# EAGLE design fuzz_sch (EAGLE 8.0.2)
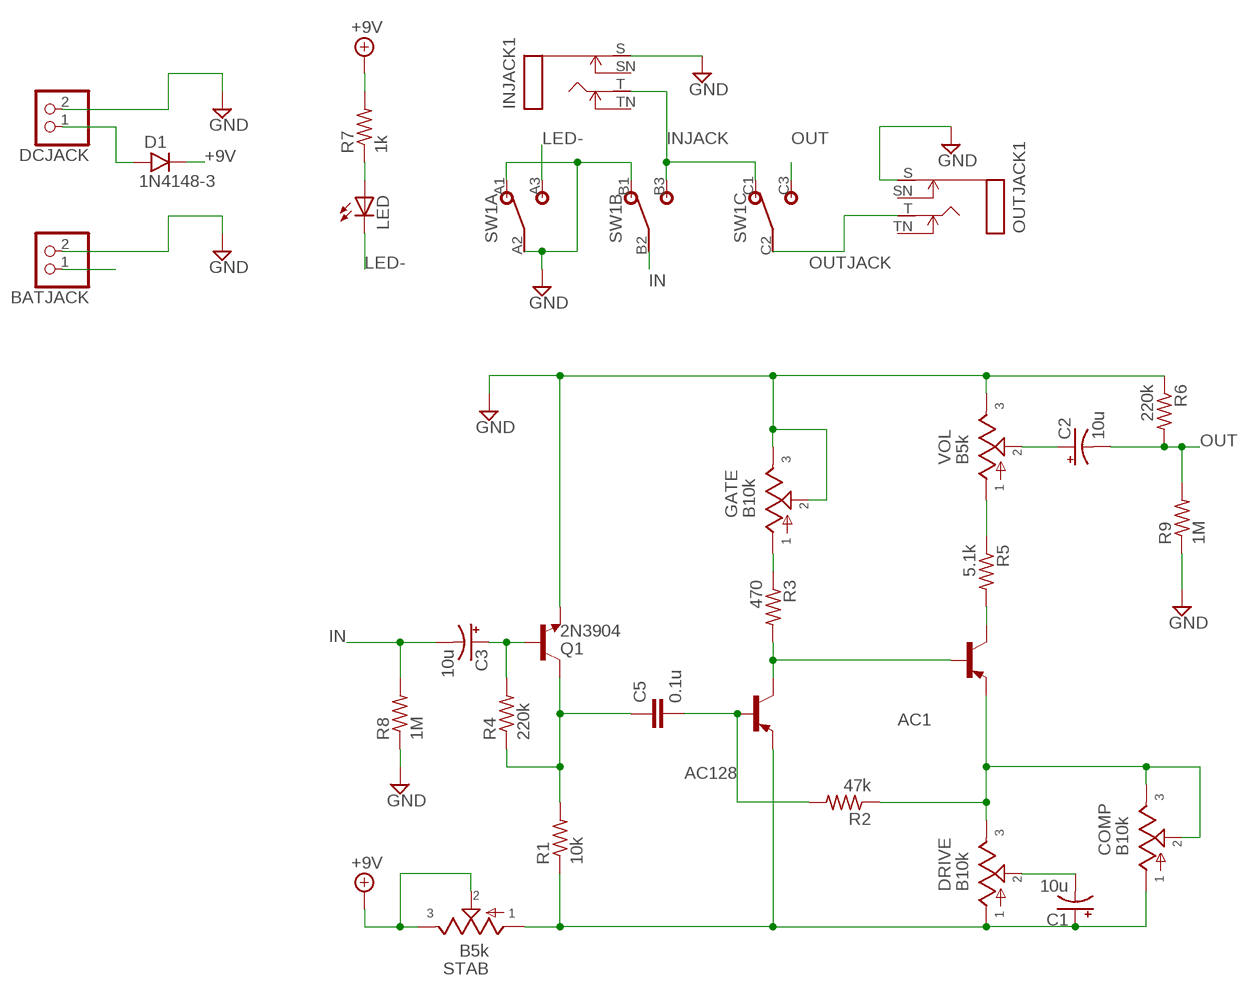
[diagram p0: schematic, sheet 1]

## Parts
AC1  -PNP-TO5  [TO5]
AC128  -PNP-TO5  [TO5]
BATJACK  PINHD-1X2  [1X02]
C1  10u  0631  [063_025]
C2  10u  0631  [063_025]
C3  10u  0631  [063_025]
C5  0.1u  072X0352  [072X035]
COMP  B10k  POT16MM  [16MM]
D1  1N4148-3  [DO35-3]
DCJACK  PINHD-1X2  [1X02]
DRIVE  B10k  POT16MM  [16MM]
GATE  B10k  POT16MM  [16MM]
INJACK1  MONOSWS  [NMJ4HC-S]
LED  LED5MM  [LED5MM]
OUTJACK1  MONOSWS  [NMJ4HC-S]
Q1  2N3904  [TO92-]
R1  10k  R-US_0207/10  [0207/10]
R2  47k  R-US_0207/10  [0207/10]
R3  470  R-US_0207/10  [0207/10]
R4  220k  R-US_0207/10  [0207/10]
R5  5.1k  R-US_0207/10  [0207/10]
R6  220k  R-US_0207/10  [0207/10]
R7  1k  R-US_0207/10  [0207/10]
R8  1M  R-US_0207/10  [0207/10]
R9  1M  R-US_0207/10  [0207/10]
STAB  B5k  POT16MM  [16MM]
SW1  3PDTBLUE  [CHINABLUE]
VOL  B5k  POT16MM  [16MM]

## Nets
+9V: BATJACK.1 D1.C R7.2 STAB.2 STAB.3
GND: BATJACK.2 DCJACK.2 GATE.2 GATE.3 INJACK1.S OUTJACK1.S Q1.3(E) R6.1 R8.1 R9.1 SW1.A1 SW1.A2 SW1.B1 VOL.3
IN: C3.- R8.2 SW1.B2
INJACK: INJACK1.T SW1.B3 SW1.C1
LED-: LED.K(C) SW1.A3
N$1: C3.+ Q1.2(B) R4.2
N$2: C5.1 Q1.1(C) R1.2 R4.1
N$3: AC128.1(E) C1.+ COMP.1 DRIVE.1 R1.1 STAB.1
N$4: AC128.2(B) C5.2 R2.2
N$5: C2.+ VOL.2
N$6: AC1.2(B) AC128.3(C) R3.2
N$7: GATE.1 R3.1
N$8: LED.A R7.1
N$9: D1.A DCJACK.1
N$10: C1.- DRIVE.2
N$11: AC1.1(E) COMP.2 COMP.3 DRIVE.3 R2.1
N$12: R5.1 VOL.1
N$13: AC1.3(C) R5.2
OUT: C2.- R6.2 R9.2 SW1.C3
OUTJACK: OUTJACK1.T SW1.C2
Unconnected: INJACK1.SN INJACK1.TN OUTJACK1.SN OUTJACK1.TN

## Library data of the parts
AC1 AC128 = transistor:*-PNP-: PNP Transistror
BATJACK DCJACK = pinhead:PINHD-1X2: PIN HEADER
C1-C3 = gm-caps-electro-pol:063: 33 - 220uF Xicon values at Mouser.com 10V: 220uF; 16V: 100uF; 25V: 100uF; 50V: 33uF
C5 = gm-caps-film-box:072X035: 0.15 - 1.0uF; WIMA MKP2 63, 100V: 0.047uF; MKS2 50V: 0.68 - 1.0uF; 63V: 0.33 - 0.47uF; 100V: 0.15 - 0.22uF;
COMP DRIVE GATE STAB VOL = gm-pots:POT: Potentiometers the arrow indicates the clockwise motion of th wiper (lug 2) fully counter clockwise there is no resistance between lugs 1 and 2 fully clockwise the resistance between lugs 1 and 2 is the value of the pot
D1 = gm-diodes:1N4148: Fast Switching Diode DO-35 glass case a.k.a. 1N914
INJACK1 OUTJACK1 = gm-jacks:MONOSW
LED = led:LED: LED OSRAM: - CHIPLED LG R971, LG N971, LY N971, LG Q971, LY Q971, LO R971, LY R971 LH N974, LH R974 LS Q976, LO Q976, LY Q976 LO Q996 - Hyper CHIPLED LW Q18S LB Q993, LB Q99A, LB R99A - SideLED LS A670, LO A670, LY A670, LG A670, LP A670 LB A673, LV A673, LT A673, LW A673 LH A674 LY A675 LS A676, LA A676, LO A676, LY A676, LW A676 LS A679, LY A679, LG A679 - Hyper Micro SIDELED® LS Y876, LA Y876, LO Y876, LY Y876 LT Y87S - SmartLED LW L88C, LW L88S LB L89C, LB L89S, LG L890 LS L89K, LO L89K, LY L89K LS L896, LA L896, LO L896, LY L896 - TOPLED LS T670, LO T670, LY T670, LG T670, LP T670 LSG T670, LSP T670, LSY T670, LOP T670, LYG T670 LG T671, LOG T671, LSG T671 LB T673, LV T673, LT T673, LW T673 LH T674 LS T676, LA T676, LO T676, LY T676, LB T676, LH T676, LSB T676, LW T676 LB T67C, LV T67C, LT T67C, LS T67K, LO T67K, LY T67K, LW E67C LS E67B, LA E67B, LO E67B, LY E67B, LB E67C, LV E67C, LT E67C LW T67C LS T679, LY T679, LG T679 LS T770, LO T770, LY T770, LG T770, LP T770 LB T773, LV T773, LT T773, LW T773 LH T774 LS E675, LA E675, LY E675, LS T675 LS T776, LA T776, LO T776, LY T776, LB T776 LHGB T686 LT T68C, LB T68C - Hyper Mini TOPLED® LB M676 - Mini TOPLED Santana® LG M470 LS M47K, LO M47K, LY M47K Source: http://www.osram.convergy.de LUXEON: - LUMILED® LXK2-PW12-R00, LXK2-PW12-S00, LXK2-PW14-U00, LXK2-PW14-V00 LXK2-PM12-R00, LXK2-PM12-S00, LXK2-PM14-U00 LXK2-PE12-Q00, LXK2-PE12-R00, LXK2-PE12-S00, LXK2-PE14-T00, LXK2-PE14-U00 LXK2-PB12-K00, LXK2-PB12-L00, LXK2-PB12-M00, LXK2-PB14-N00, LXK2-PB14-P00, LXK2-PB14-Q00 LXK2-PR12-L00, LXK2-PR12-M00, LXK2-PR14-Q00, LXK2-PR14-R00 LXK2-PD12-Q00, LXK2-PD12-R00, LXK2-PD12-S00 LXK2-PH12-R00, LXK2-PH12-S00 LXK2-PL12-P00, LXK2-PL12-Q00, LXK2-PL12-R00 Source: www.luxeon.com KINGBRIGHT: KA-3528ASYC Source: www.kingbright.com
Q1 = gm-trans:2N3904: NPN Transistor
R1-R9 = resistor:R-US_: RESISTOR, American symbol
SW1 = gm-switches:3PDT

## Board
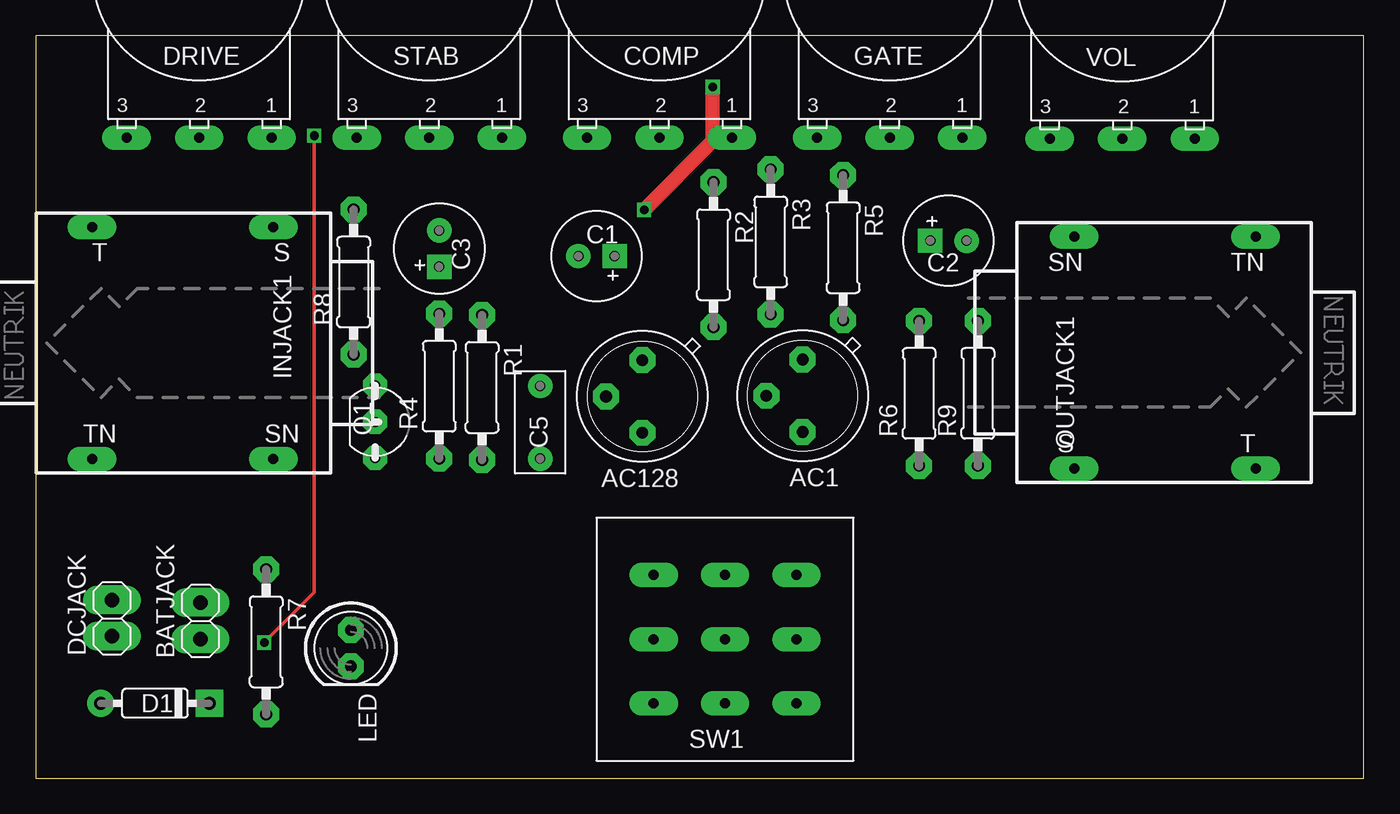
[diagram p1: board, top side]
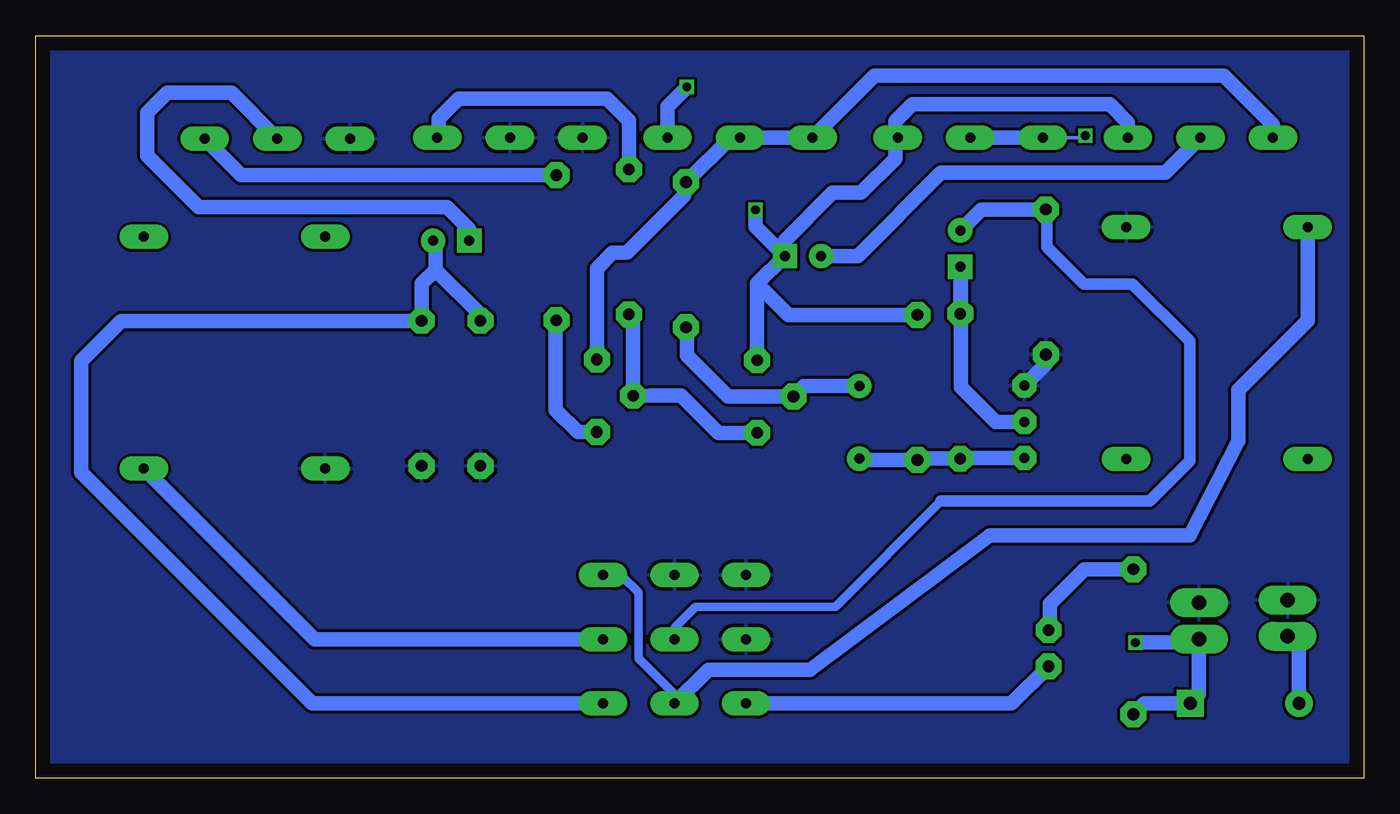
[diagram p2: board, bottom side, seen from below]

Size 93 x 52 mm. Coordinates in mm from the lower left corner, seen from the top.
Outline: 0,0 93,0 93,52 0,52 0,0
Copper layers (1*16): Top 0.035mm / dielectric 1.5mm / Bottom 0.035mm
Design rules "default *": minimum track width 10mil, minimum drill 24mil, track to track 8mil, track to pad 8mil, pad to pad 8mil, via to via 8mil, smd to smd 8mil, copper to edge 40mil, drill to drill 8mil, minimum pad ring 0.5mm, minimum via ring 8mil, stop-mask expansion 4mil, vias tented up to drill 0mil, thermal gap 10mil

### Footprints (pad centres in the part's own frame; a part is rotated, then mirrored left to right if it is on the bottom)
TO5 = drill 0.813 octagon: 1 0,-2.54; 2 2.54,0; 3 0,2.54
1X02 = drill 1.016 long: 1 -1.27,0; 2 1.27,0
063_025 = drill 0.7 square: + -1.27,0 | drill 0.7: - 1.27,0
072X035 = drill 0.7: 1 -2.54,0; 2 2.54,0
16MM = drill 0.7 long: 1 5.08,0; 2 0,0; 3 -5.08,0
DO35-3 = drill 0.9: A 3.81,0 | drill 0.9 square: C -3.81,0
NMJ4HC-S = drill 0.7 long: S 5.08,8.115; SN 5.08,-8.115; T -7.62,8.115; TN -7.62,-8.115
LED5MM = drill 0.813 octagon: A -1.27,0; K 1.27,0
TO92- = drill 0.7 octagon: 1 2.54,0; 2 0,0; 3 -2.54,0
0207/10 = drill 0.813 octagon: 1 -5.08,0; 2 5.08,0
CHINABLUE = drill 0.7 long: A1 -5,4.5; A2 -5,0; A3 -5,-4.5; B1 0,4.5; B2 0,0; B3 0,-4.5; C1 5,4.5; C2 5,0; C3 5,-4.5

### Placement (x,y rotation side)
AC1  53.7,26.78 180 top
AC128  42.48,26.73 180 top
BATJACK  11.54,11.02 90 top
C1  39.27,36.56 180 top
C2  63.91,37.64 0 top
C3  28.26,37.09 90 top
C5  35.33,24.92 90 top
COMP  43.68,44.87 0 top
D1  8.35,5.24 180 top
DCJACK  5.34,11.2 90 top
DRIVE  11.44,44.87 0 top
GATE  59.8,44.87 0 top
INJACK1  11.56,30.48 0 top
LED  22.07,9.1 270 top
OUTJACK1  77.8,29.8 180 top
Q1  23.77,24.96 270 top
R1  31.26,27.36 270 top
R2  47.46,36.66 270 top
R3  51.46,37.56 270 top
R4  28.26,27.45 90 top
R5  56.54,37.15 270 top
R6  61.86,26.95 90 top
R7  16.14,9.55 270 top
R8  22.26,34.75 90 top
R9  65.98,26.95 90 top
STAB  27.56,44.87 0 top
SW1  48.27,9.73 0 top
VOL  76.08,44.79 0 top

### Tracks (layer width: path | path; a pad name or v marks a point on that pad's centre or on a via)
+9V  (via drill 0.6)
  Top 0.254: v19.5,45 19.5,13 v16,9.5
  Bottom 0.254: STAB.3 19.63,44.87 v19.5,45
  Bottom 1.016: R7.2 15.37,5.24 D1.C 11.54,5.86 BATJACK.1 11.79,9.5 v16,9.5 | STAB.2 STAB.3
GND
  Bottom 1.016: R8.1 22.26,29.01 Q1.3
  pour Bottom: 0,52 0,0 93,0 93,52
IN
  Bottom 0.61: SW1.B2 48.27,10.53 46.8,12 37,12 29.6,19.4
  Bottom 0.813: 29.6,19.4 15,19.4 12.2,22.2 12.2,30.6 16.2,34.6 19.6,34.6 22.2,37.2 22.2,39.77 R8.2
  Bottom 1.016: R8.2 26.79,39.83 C3.-
INJACK
  Bottom 0.61: SW1.B3 48.27,5.87 50.8,8.4 50.8,13 52,14.2 53.24,14.2 SW1.C1
  Bottom 1.016: INJACK1.T 3.94,32.06 8.8,27.2 8.8,23.6 12.2,17 26.2,17 38.8,7.6 45.9,7.6 SW1.B3
LED-
  Bottom 1.016: SW1.A3 24.67,5.23 LED.K
N$1
  Bottom 1.016: Q1.2 25.76,24.96 28.2,27.4 28.2,35.76 C3.+ R4.2
N$2
  Bottom 1.016: Q1.1 28.21,22.42 R4.1 31.17,22.37 R1.2 35.23,22.28 C5.1
N$3  (via drill 0.6)
  Top 1.016: v47.4,48.4 47.4,44.6 v42.6,39.8
  Bottom 1.016: 42.48,34.62 AC128.1 | C1.+ 42.48,34.62 | C1.+ 40.54,37.66 37.2,41 35.2,41 32.8,43.4 32.8,44.71 STAB.1 32.8,45.03 32.8,46 31.6,47.2 17.8,47.2 16.52,45.92 DRIVE.1 | COMP.1 48.76,47.04 v47.4,48.4 | v42.6,39.8 42.6,38.62 C1.+ | R1.1 40.3,32.44 42.48,34.62
N$4
  Bottom 1.016: C5.2 39.21,27.46 AC128.2 44.53,26.73 47.4,29.6 47.4,31.52 R2.2
N$5
  Bottom 1.016: C2.+ 62.64,38.44 64.2,40 81.6,40 85.2,43.6 85.2,46.6 83.8,48 79.29,48 VOL.2
N$6
  Bottom 1.016: AC128.3 45.19,24.19 47.8,26.8 49.94,26.8 AC1.2 51.16,32.18 R3.2
N$7
  Bottom 1.016: R3.1 51.46,46.06 53,47.6 63.4,47.6 64.8,46.2 64.8,44.95 GATE.1
N$8
  Bottom 1.016: R7.1 19.57,14.63 22,12.2 22,10.44 LED.A
N$9
  Bottom 1.016: D1.A 4.54,9.13 DCJACK.1
N$10
  Bottom 1.016: C1.- 35.44,36.56 29.6,42.4 13.91,42.4 DRIVE.2
N$11
  Bottom 1.016: AC1.1 53.7,35.7 52.6,36.8 51.6,36.8 47.6,40.8 47.6,41.6 R2.1 44.33,44.87 COMP.2 COMP.3 34.27,49.2 9.8,49.2 6.36,45.76 DRIVE.3
N$12
  Bottom 1.016: R5.1 78.6,42.23 VOL.1
N$13
  Bottom 1.016: AC1.3 55.04,24.24 56.6,25.8 56.6,32.01 R5.2
OUT
  Bottom 1.016: R6.2 61.86,32.46 65,35.6 | 65,35.6 65,37.46 C2.- | 65,35.6 65.98,34.62 R9.2 66.01,32 87,32 89.8,29.2 89.8,21.4 73.63,5.23 SW1.C3
OUTJACK
  Bottom 1.016: SW1.C2 73.47,9.73 OUTJACK1.T